# EAGLE design mosfet-sot23-3 (EAGLE 5.10)
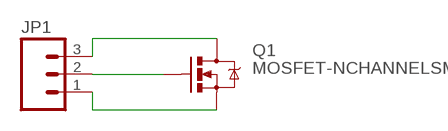
[diagram p0: schematic, sheet 1]

## Parts
JP1  M03LOCK_LONGPADS  [1X03_LOCK_LONGPADS]
Q1  MOSFET-NCHANNELSMD  [SOT23-3]

## Nets
N$1: JP1.3 Q1.3(D)
N$2: JP1.2 Q1.1(G)
N$3: JP1.1 Q1.2(S)

## Library data of the parts
JP1 = SparkFun:M03: Header 3 Standard 3-pin 0.1" header. Use with straight break away headers (SKU : PRT-00116), right angle break away headers (PRT-00553), swiss pins (PRT-00743), machine pins (PRT-00117), and female headers (PRT-00115). Molex polarized connector foot print use with SKU : PRT-08232 with associated crimp pins and housings.
Q1 = ideabot:MOSFET-NCHANNEL

## Board
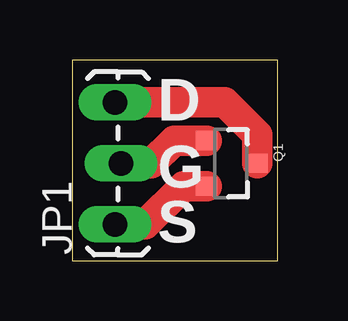
[diagram p1: board, top side]

Size 8.56 x 8.37 mm. Coordinates in mm from the lower left corner, seen from the top.
Outline: 0,0 8.56,0 8.56,8.37 0,8.37 0,0
Copper layers (1*16): Top 0.035mm / dielectric 1.5mm / Bottom 0.035mm
Design rules "default": minimum track width 10mil, minimum drill 24mil, track to track 8mil, track to pad 8mil, pad to pad 8mil, via to via 8mil, smd to smd 8mil, copper to edge 40mil, drill to drill 8mil, minimum pad ring 10mil, minimum via ring 8mil, stop-mask expansion 4mil, vias tented up to drill 0mil, thermal gap 10mil

### Footprints (pad centres in the part's own frame; a part is rotated, then mirrored left to right if it is on the bottom)
1X03_LOCK_LONGPADS = drill 1.016 long: 1 0,0; 2 2.54,-0.254; 3 5.08,0
SOT23-3 = smd 0.8 x 0.9: 1 -0.95,-1; 2 0.95,-1; 3 0,1.1

### Placement (x,y rotation side)
JP1  1.78,1.52 90 top
Q1  6.6,4.06 270 top

### Tracks (layer width: path | path; a pad name or v marks a point on that pad's centre or on a via)
N$1
  Top 1.27: Q1.3 7.7,5.25 6.35,6.6 JP1.3
N$2
  Top 1.27: Q1.1 4.25,5.01 3.3,4.06 JP1.2
N$3
  Top 1.27: Q1.2 4.64,3.11 3.05,1.52 JP1.1

### Text on the board
tNames: D | G | S